# EAGLE design 4-IN-OPTPO-4-OUT (EAGLE 7.7.0)
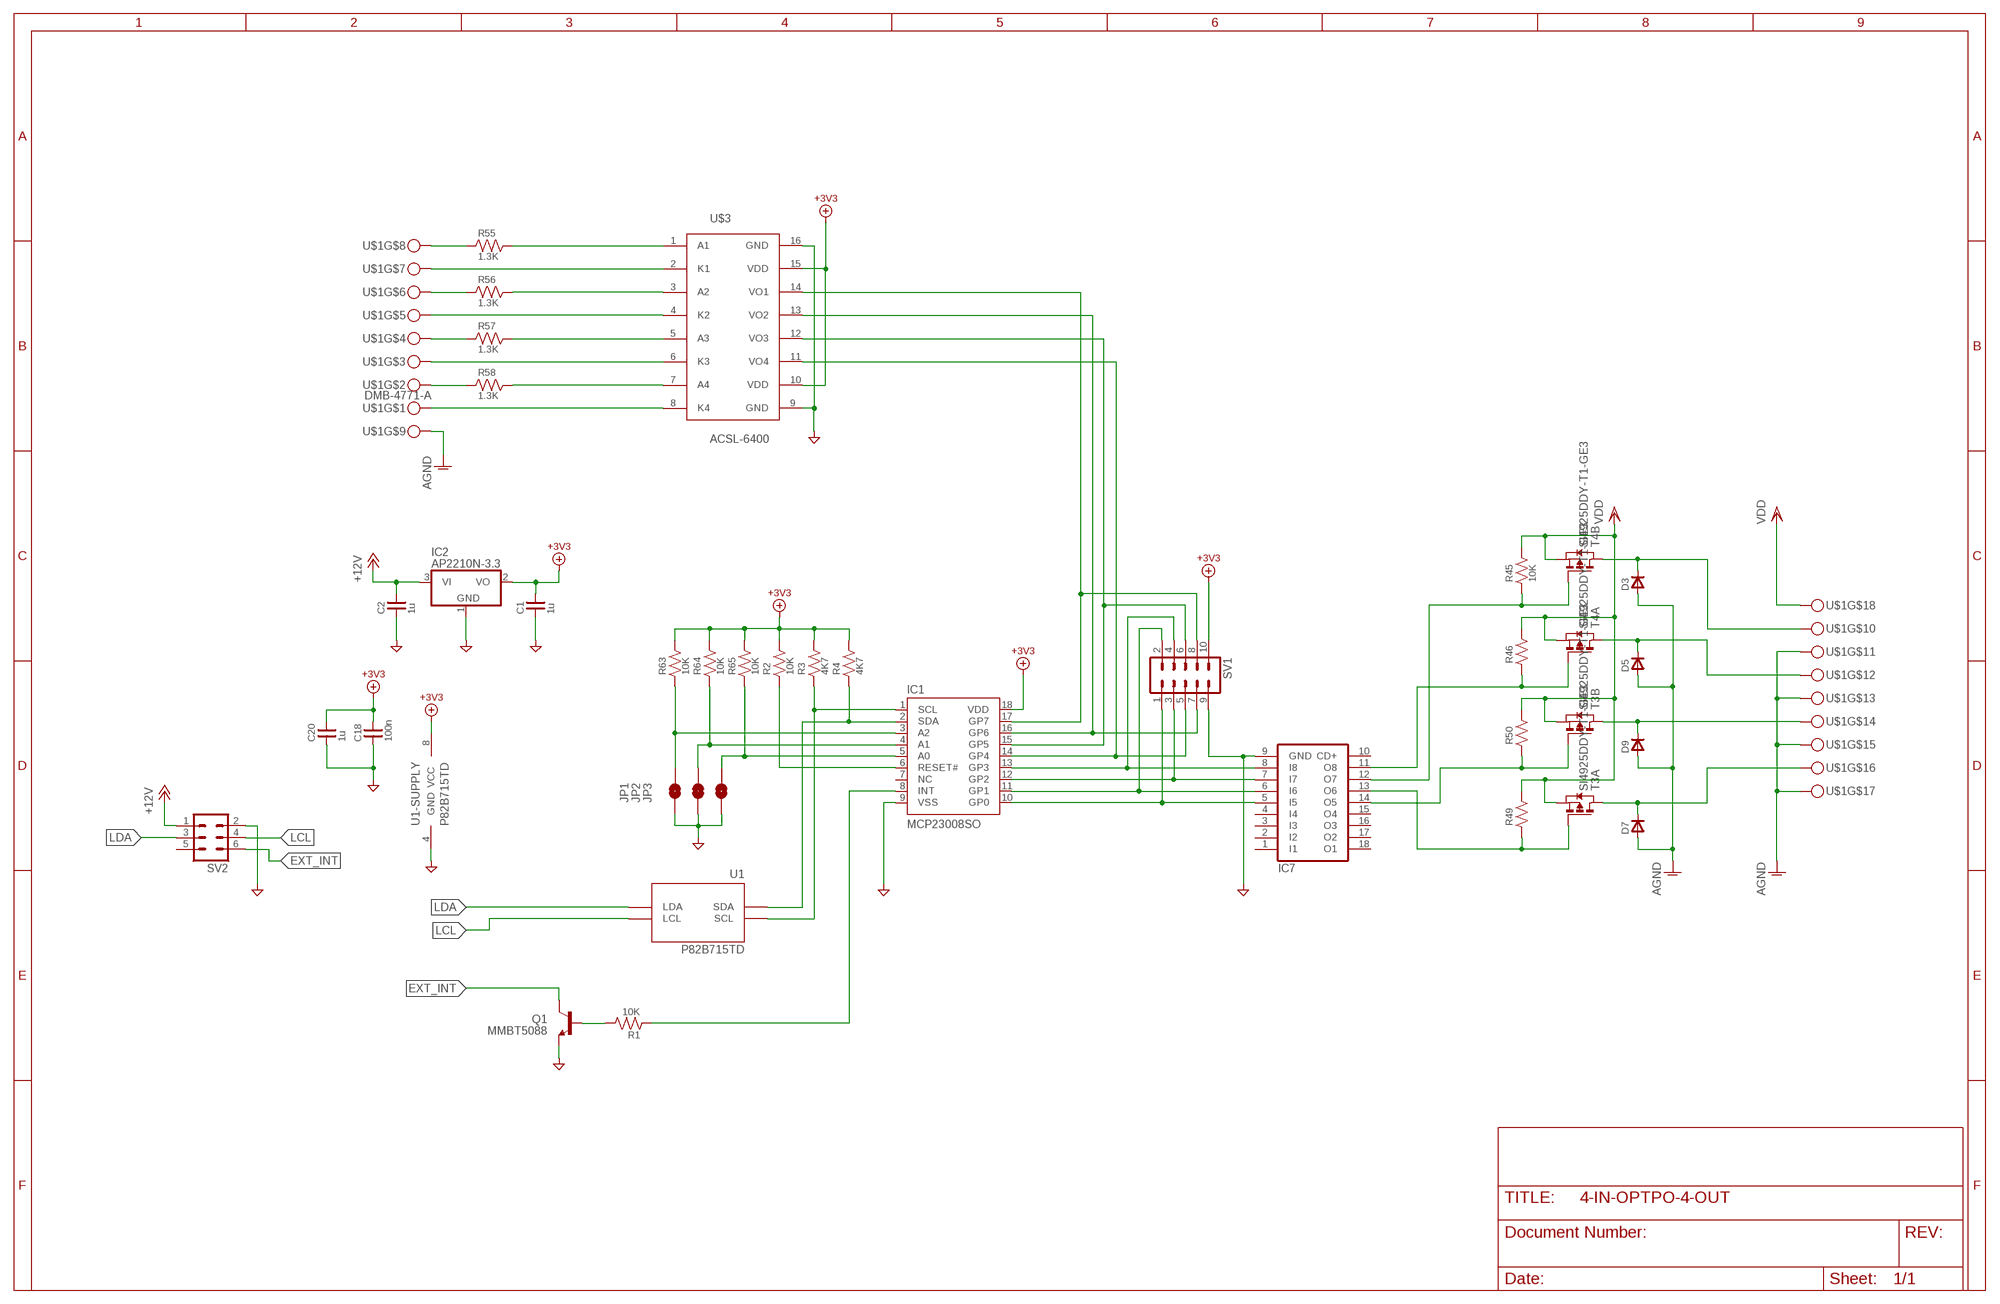
[diagram p0: schematic, sheet 1]

## Parts
C1  1u  C0805  [C0805]
C2  1u  C0805  [C0805]
C18  100n  C0805  [C0805]
C20  1u  C0805  [C0805]
D3  DSMA  [DSMA]
D5  DSMA  [DSMA]
D7  DSMA  [DSMA]
D9  DSMA  [DSMA]
IC1  MCP23008SO  [SO-18W]
IC2  AP2210N-3.3  MCP1703CB  [SOT23]
IC7  ULN2803A  [SO18W]
JP1  JUMPER-PAD-2-NOYES_SILK  [PAD-JUMPER-2-NO_YES_SILK]
JP2  JUMPER-PAD-2-NOYES_SILK  [PAD-JUMPER-2-NO_YES_SILK]
JP3  JUMPER-PAD-2-NOYES_SILK  [PAD-JUMPER-2-NO_YES_SILK]
Q1  MMBT5088  TRANSISTOR_NPNMMBT5088  [SOT23-3]
R1  10K  RU0805  [R0805]
R2  10K  RU0805  [R0805]
R3  4K7  RU0805  [R0805]
R4  4K7  RU0805  [R0805]
R45  10K  RU0805  [R0805]
R46  RU0805  [R0805]
R49  RU0805  [R0805]
R50  RU0805  [R0805]
R55  1.3K  RU0805  [R0805]
R56  1.3K  RU0805  [R0805]
R57  1.3K  RU0805  [R0805]
R58  1.3K  RU0805  [R0805]
R63  10K  RU0805  [R0805]
R64  10K  RU0805  [R0805]
R65  10K  RU0805  [R0805]
SV1  ML10  [ML10]
SV2  ML6  [ML6]
T3  SI4925DDY-T1-GE3  PMOS2SO8  [SO8]
T4  SI4925DDY-T1-GE3  PMOS2SO8  [SO8]
U1  P82B715TD  [SOIC-8]
U$1  DMB-4771-A  [DMB-4771-A-PKG]
U$3  ACSL-6400  [SO16]

## Nets
+3V3: C1.2 C18.2 C20.2 IC1.18(VDD) IC2.2(VO) R2.2 R3.2 R4.2 R63.2 R64.2 R65.2 SV1.10 U1.8(VCC) U$3.10(VDD) U$3.15(VDD) ; supply symbol labelled V+3V3
+12VBUS: C2.2 IC2.3(VI) SV2.1 ; supply symbol labelled +12V
AGND: D3.A D5.A D7.A D9.A U$1.P$9 U$1.P$11 U$1.P$13 U$1.P$15 U$1.P$17
DGND: C1.1 C2.1 C18.1 C20.1 IC1.9(VSS) IC2.1(GND) IC7.9(GND) JP1.1 JP2.1 JP3.1 Q1.2(E) SV1.9 SV2.2 U1.4(GND) U$3.9(GND) U$3.16(GND) ; supply symbol labelled VDG
EXT_INT: Q1.3(C) SV2.6
LCL: SV2.4 U1.2(LCL)
LDA: SV2.3 U1.7(LDA)
N$1: R55.1 U$1.P$8
N$2: R56.1 U$1.P$6
N$3: R57.1 U$1.P$4
N$4: R58.1 U$1.P$2
N$5: IC1.13(GP3) IC7.8(I8) SV1.4
N$6: IC1.12(GP2) IC7.7(I7) SV1.3
N$7: IC1.11(GP1) IC7.6(I6) SV1.2
N$8: IC1.10(GP0) IC7.5(I5) SV1.1
N$9: IC1.1(SCL) R3.1 U1.3(SCL)
N$10: IC1.2(SDA) R4.1 U1.6(SDA)
N$11: IC1.8(INT) R1.1
N$12: Q1.1(B) R1.2
N$13: IC1.6(RESET#) R2.1
N$16: IC1.16(GP6) SV1.7 U$3.13(VO2)
N$17: U$1.P$7 U$3.2(K1)
N$18: U$1.P$5 U$3.4(K2)
N$19: U$1.P$3 U$3.6(K3)
N$20: U$1.P$1 U$3.8(K4)
N$80: IC7.12(O7) R45.1 T4.4(B:G)
N$81: IC7.11(O8) R46.1 T4.2(A:G)
N$82: IC7.13(O6) R49.1 T3.2(A:G)
N$83: IC7.14(O5) R50.1 T3.4(B:G)
N$95: D3.C T4.5(B:D) T4.6(B:D) U$1.P$10
N$96: D5.C T4.7(A:D) T4.8(A:D) U$1.P$12
N$97: D7.C T3.7(A:D) T3.8(A:D) U$1.P$16
N$98: D9.C T3.5(B:D) T3.6(B:D) U$1.P$14
N$111: R55.2 U$3.1(A1)
N$112: R56.2 U$3.3(A2)
N$113: R57.2 U$3.5(A3)
N$114: R58.2 U$3.7(A4)
N$125: IC1.17(GP7) SV1.8 U$3.14(VO1)
N$129: IC1.15(GP5) SV1.6 U$3.12(VO3)
N$131: IC1.14(GP4) SV1.5 U$3.11(VO4)
N$132: IC1.5(A0) JP3.2 R65.1
N$133: IC1.4(A1) JP2.2 R64.1
N$134: IC1.3(A2) JP1.2 R63.1
VDD: R45.2 R46.2 R49.2 R50.2 T3.1(A:S) T3.3(B:S) T4.1(A:S) T4.3(B:S) U$1.P$18
Unconnected: IC1.7(NC) IC7.1(I1) IC7.2(I2) IC7.3(I3) IC7.4(I4) IC7.10(CD+) IC7.15(O4) IC7.16(O3) IC7.17(O2) IC7.18(O1) SV2.5

## Library data of the parts
C1 C2 C18 C20 = divers:C: Capacitor bipolar
D3 D5 D7 D9 = diodes:D: Diode
IC1 = microchip-dspic:MCP23008: 8-Bit I/O Expander with I2C Interface
IC2 = linear:MCP1703: 250 mA, 16V, Low Quiescent Current LDO Regulator Source: http://ww1.microchip.com/downloads/en/DeviceDoc/22049b.pdf
IC7 = uln-udn:ULN2803A: DRIVER ARRAY
JP1-JP3 = SparkFun-Passives:JUMPER-PAD-2-NO
Q1 = SparkFun-DiscreteSemi:TRANSISTOR_NPN: Generic NPN BJT MMBT2222A - TRANS-08049 (SOT-23, 1A 40V) MPSA42 - TRANS-09116 (SOT-23, 500mA 300V) MMBT5088LT1G - TRANS-11160 (SOT-23, 50 mA 30V) BC547 - COM-08928 <http://www.sparkfun.com/products/8928> (TO-92 45V 100mA) (1.Collector 2.Base 3.Emitter) 2N3904 - COM-00521 <http://www.sparkfun.com/products/521> (TO-92 40V 200mA) (1.Emitter 2.Base 3.Collector) P2N2222A - COM-12852 <http://www.sparkfun.com/products/12852> (TO-92 40V 600mA) (1.Collector 2.Base 3.Emitter); PROD_ID: TRANS-11160
R1-R4 R45 R46 R49 R50 R55-R58 R63-R65 = divers:RU: Resistor, US symbol
SV1 = con-harting-ml:ML10: HARTING; OC_FARNELL: unknown; OC_NEWARK: unknown
SV2 = con-harting-ml:ML6: HARTING; OC_FARNELL: unknown; OC_NEWARK: unknown
T3 T4 = zetex:PMOS2: DUAL 30V P-CHANNEL ENHANCEMENT MODE MOSFET Source: Data sheet <http://www.diodes.com/datasheets/ZXMP3A16DN8.pdf> SOP8 Source: Data sheet <http://www.diodes.com/datasheets/ZXMD63P03X.pdf> MSOP8; OC_FARNELL: unknown; OC_NEWARK: unknown
U1 = Volks73-NXPSemiconductors:P82B715?: I2C-Bus Extender I2C-bus extender Documentation Datasheet <http://www.nxp.com/documents/data_sheet/P82B715.pdf> General Description The P82B715 is a bipolar IC intended for application in I2C-bus and derivative bus systems. While retaining all the operating modes and features of the I2C-bus it permits extension of the practical separation distance between components on the I2C-bus by buffering both the data (SDA) and the clock (SCL) lines. The I2C-bus capacitance limit of 400 pF restricts practical communication distances to a few meters. Using one P82B715 at each end of a long cable (connecting Lx/Ly to Lx/Ly) reduces that cable’s loading on the linked I2C-buses by a factor of 10 and allows the total system capacitance load (all devices, cable, connectors, and traces or wires connected to the I2C-bus) to be around 3000 pF while the loading on each I2C-bus on the Sx/Sy sides remains below 400 pF. Longer cables or low-cost, general-purpose wiring may be used to link I2C-bus based modules without degrading noise margins. Multiple P82B715s can be connected together, linking their Lx/Ly ports, in a star or multi-point architecture as long as the total capacitance of the system is less than about 3000 pF and each bus at an Sx/Sy connection is well below 400 pF. This configuration, with the master and/or slave devices attached to the Sx/Sy port of each P82B715, has full multi-master communication capability. The P82B715 alone does not support voltage level translation, but it can be simply implemented using low cost transistors when required. There is no restriction on interconnecting the Sx/Sy I/Os, and, because the device output levels are always held within 100 mV of input drive levels, P82B715 is compatible with bus buffers that use voltage level offsets, e.g., PCA9511A, PCA9517, Sx/Sy side of P82B96. The lower VOL level and ability to operate with any master, slave or bus buffer is the primary advantage of the using the P82B715 for long distance buses at the disadvantage of not isolating bus capacitance like the P82B96 or PCA9600 are able to do. The primary disadvantage of the P82B96 and PCA9600 is that the static level offset needed to isolate bus capacitance does not allow these devices to operate with other bus buffers with special offset levels or with master/slaves that require a VIL lower than 0.8 V with noise margin. A proven quick design-in point-to-point/multi-point circuit (Figure 9) is included in Section 8.2 to allow rapid use of the P82B715 along with comparison waveforms so that the designer can clearly see the trade-offs between the P82B715 and the P82B96/PCA9600 and choose the type of device that is best for their application. Features Dual, bidirectional, unity voltage gain buffer with no external directional control required Compatible with I2C-bus and its derivatives SMBus, PMBus, DDC, etc. Logic signal levels may include (but not exceed) both supply and ground Logic signal input voltage levels are output without change and are independent of VCC ×10 impedance transformation, but does not change logic voltage levels Supply voltage range 3 V to 12 V Clock speeds to at least 100 kHz and 400 kHz when other system delays permit ESD protection exceeds 2500 V HBM per Mil. Std 883C-3015.7 and 400 V MM per JESD22-A115 (I/Os have diodes to VCC and GND) Latch-up testing is done to JEDEC Standard JESD78 which exceeds 100 mA Applications Increase the total connected capacitance of an I2C-bus system to around 3000 pF Drive I2C-bus signals over long cables to approximately 50 meters or 3000 pF Drives ×10 lower impedance bus wiring for improved noise immunity Multi-drop distribution of I2C-bus signals using low cost twisted-pair cables AdvancedTCA radial IPMB architecture Driving 30 mA Fm+ devices from standard 3 mA parts; APPLICATIONS: I2C; CAPACITANCE-INPUT: 3000pF; CURRENT_SUPPLY: 22mA; DATA_RATE: 400kHz; DELAY_TIME: -; DESCRIPTION: IC REDRIVER I2C 1CH 400KHZ 8SO; DOCUMENTATION_LINK: <a href="http://www.nxp.com/documents/data_sheet/P82B715.pdf">Datasheet</a>; DOCUMENTATION_URL: http://www.nxp.com/documents/data_sheet/P82B715.pdf; INPUT: 2-Wire Buse; MANUFACTURER: NXP Semiconductors; NUMBER_OF_CHANNELS: 1; OPERATING_TEMPERATURE: -40C ~ 85C; OUTPUT: 2-Wire Bus; PART_NUMBER: P82B715TD,118; SIGNAL_CONDITIONING: -; SUPPLIER_ITEM_LINK: <a href="http://www.digikey.com/product-detail/en/P82B715TD,118/568-1007-2-ND/735621">Details</a>; SUPPLIER_ITEM_NUMBER: 568-1007-2-ND; SUPPLIER_ITEM_URL: http://www.digikey.com/product-detail/en/P82B715TD,118/568-1007-2-ND/735621; SUPPLIER_LINK: <a href="http://www.digikey.com">Home Page</a>; SUPPLIER_NAME: Digi-Key; SUPPLIER_URL: http://www.digikey.com; TYPE: Buffer, ReDriver; VOLTAGE_SUPPLY: 4.5V ~ 12V
U$1 = Cedric:DMB-4771-A
U$3 = avago:ACSL-6400

## Board
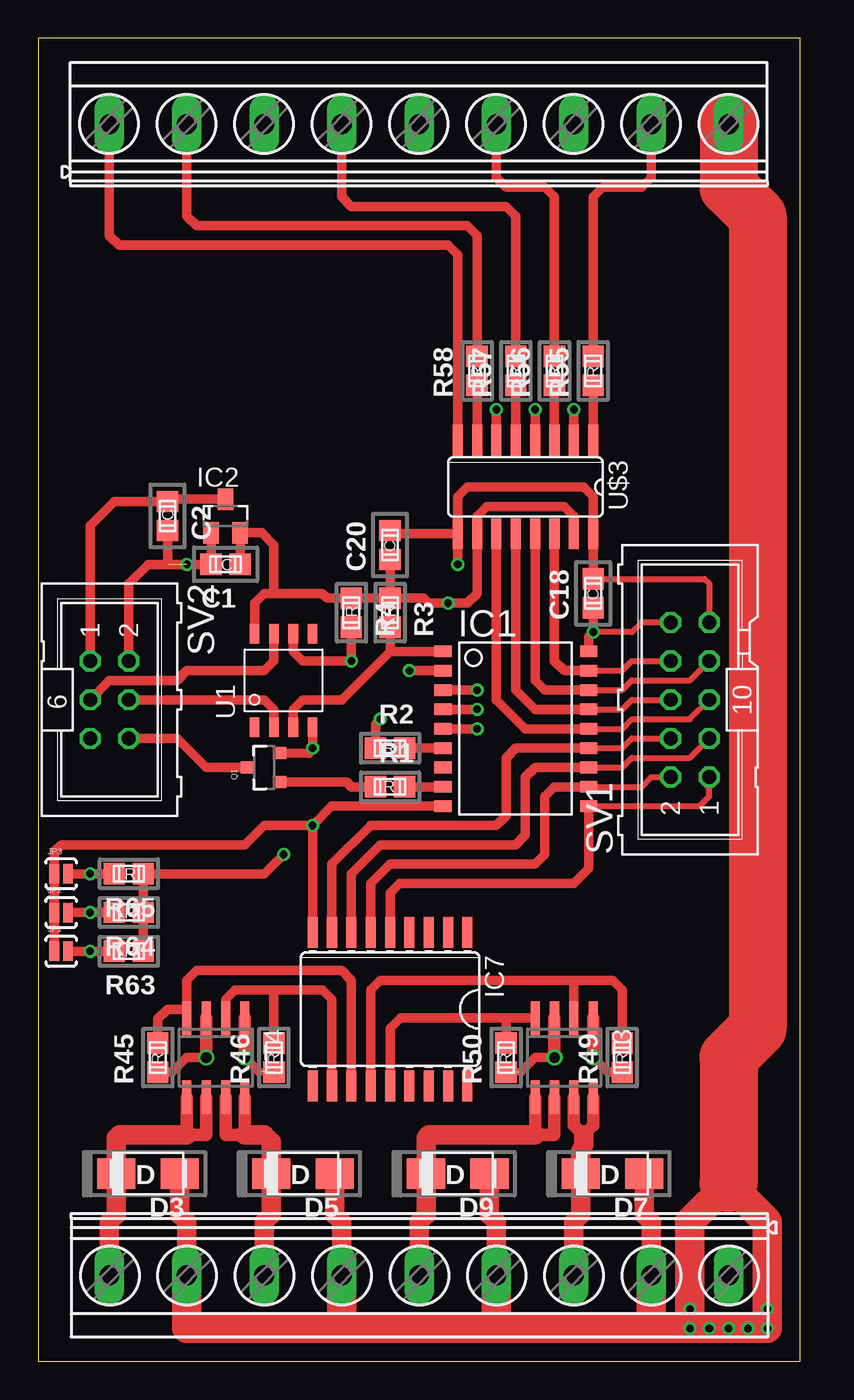
[diagram p1: board, top side]
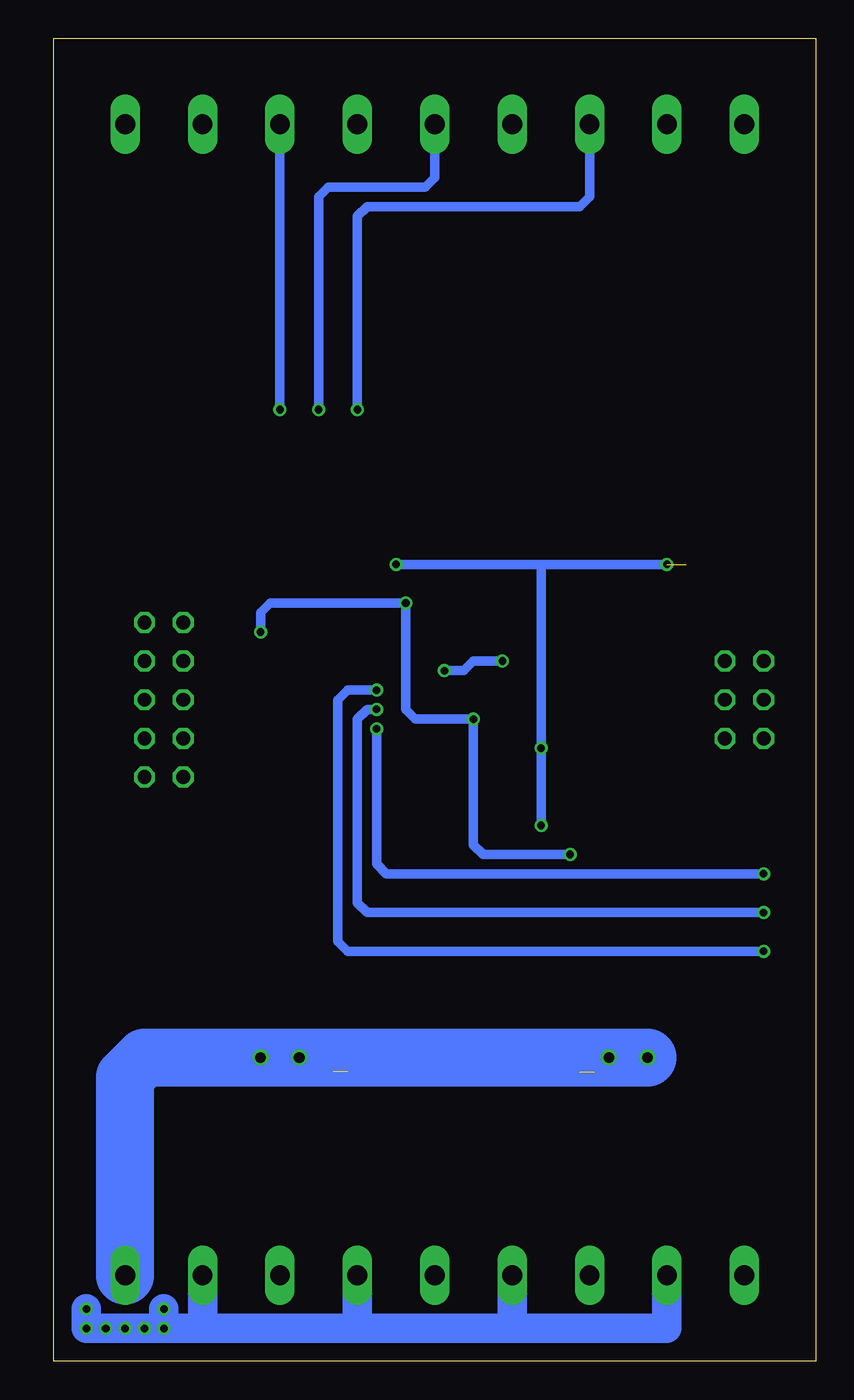
[diagram p2: board, bottom side, seen from below]

Size 50.01 x 86.89 mm. Coordinates in mm from the lower left corner, seen from the top.
Copper layers (1*16): Top 0.0356mm / dielectric 1.5011mm / Bottom 0.0356mm
Design rules "oshpark-2layer": minimum track width 6mil, minimum drill 13mil, track to track 6mil, track to pad 6mil, pad to pad 6mil, via to via 6mil, smd to smd 6mil, copper to edge 15mil, drill to drill 6mil, minimum pad ring 7mil, minimum via ring 7mil, stop-mask expansion 2.5mil, vias tented up to drill 0mil, thermal gap 10mil

### Footprints (pad centres in the part's own frame; a part is rotated, then mirrored left to right if it is on the bottom)
C0805 = smd 1.397 x 1.397: 1 -0.953,0; 2 0.953,0
DSMA = smd 2.5 x 2: A -2.083,0; C 2.083,0
SO-18W = smd 0.762 x 1.143: 1 -5.08,-4.788; 2 -3.81,-4.788; 3 -2.54,-4.788; 4 -1.27,-4.788; 5 0,-4.788; 6 1.27,-4.788; 7 2.54,-4.788; 8 3.81,-4.788; 9 5.08,-4.788; 10 5.08,4.788; 11 3.81,4.788; 12 2.54,4.788; 13 1.27,4.788; 14 0,4.788; 15 -1.27,4.788; 16 -2.54,4.788; 17 -3.81,4.788; 18 -5.08,4.788
SOT23 = smd 1 x 1.4: 1 -0.95,-1.1; 2 0.95,-1.1; 3 0,1.1
SO18W = smd 0.66 x 2.032: 1 -5.08,-5.029; 2 -3.81,-5.029; 3 -2.54,-5.029; 4 -1.27,-5.029; 5 0,-5.029; 6 1.27,-5.029; 7 2.54,-5.029; 8 3.81,-5.029; 9 5.08,-5.029; 10 5.08,5.029; 11 3.81,5.029; 12 2.54,5.029; 13 1.27,5.029; 14 0,5.029; 15 -1.27,5.029; 16 -2.54,5.029; 17 -3.81,5.029; 18 -5.08,5.029
PAD-JUMPER-2-NO_YES_SILK = smd 0.635 x 1.27: 1 -0.45,0; 2 0.45,0
SOT23-3 = smd 0.8 x 0.9: 1 -0.95,-1; 2 0.95,-1; 3 0,1.1
R0805 = smd 1.397 x 1.397: 1 -0.953,0; 2 0.953,0
ML10 = drill 0.914 octagon: 1 -5.08,-1.27; 2 -5.08,1.27; 3 -2.54,-1.27; 4 -2.54,1.27; 5 0,-1.27; 6 0,1.27; 7 2.54,-1.27; 8 2.54,1.27; 9 5.08,-1.27; 10 5.08,1.27
ML6 = drill 0.914 octagon: 1 -2.54,-1.27; 2 -2.54,1.27; 3 0,-1.27; 4 0,1.27; 5 2.54,-1.27; 6 2.54,1.27
SO8 = smd 0.6 x 2.2: 1 -1.905,-2.6; 2 -0.635,-2.6; 3 0.635,-2.6; 4 1.905,-2.6; 5 1.905,2.6; 6 0.635,2.6; 7 -0.635,2.6; 8 -1.905,2.6
SOIC-8 = smd 1.27 x 0.635: 1 -3.073,1.905; 2 -3.073,0.635; 3 -3.073,-0.635; 4 -3.073,-1.905; 5 3.073,-1.905; 6 3.073,-0.635; 7 3.073,0.635; 8 3.073,1.905
DMB-4771-A-PKG = drill 1.3 long: P$1 -20.32,37.795; P$2 -15.24,37.795; P$3 -10.16,37.795; P$4 -5.08,37.795; P$5 0,37.795; P$6 5.08,37.795; P$7 10.16,37.795; P$8 15.24,37.795; P$9 20.32,37.795; P$10 -20.32,-37.795; P$11 -15.24,-37.795; P$12 -10.16,-37.795; P$13 -5.08,-37.795; P$14 0,-37.795; P$15 5.08,-37.795; P$16 10.16,-37.795; P$17 15.24,-37.795; P$18 20.32,-37.795
SO16 = smd 0.66 x 2.032: 1 -4.445,-3.073; 2 -3.175,-3.073; 3 -1.905,-3.073; 4 -0.635,-3.073; 5 0.635,-3.073; 6 1.905,-3.073; 7 3.175,-3.073; 8 4.445,-3.073; 9 4.445,3.073; 10 3.175,3.073; 11 1.905,3.073; 12 0.635,3.073; 13 -0.635,3.073; 14 -1.905,3.073; 15 -3.175,3.073; 16 -4.445,3.073

### Placement (x,y rotation side)
C1  12.31,52.34 0 top
C2  8.5,55.51 90 top
C18  36.44,50.43 270 top
C20  23.1,53.61 270 top
D3  7.23,12.33 180 top
D5  17.39,12.33 180 top
D7  37.71,12.33 180 top
D9  27.55,12.33 180 top
IC1  31.36,41.54 270 top
IC2  12.31,55.51 0 top
IC7  23.1,23.13 180 top
JP1  1.51,26.94 0 top
JP2  1.51,29.48 0 top
JP3  1.51,32.02 0 top
Q1  14.85,39 90 top
R1  23.1,37.73 180 top
R2  23.1,40.27 180 top
R3  23.1,49.16 90 top
R4  20.56,49.16 90 top
R45  7.86,19.95 270 top
R46  15.48,19.95 270 top
R49  38.34,19.95 270 top
R50  30.72,19.95 270 top
R55  36.44,65.04 270 top
R56  33.9,65.04 270 top
R57  31.36,65.04 270 top
R58  28.82,65.04 270 top
R63  5.96,26.94 0 top
R64  5.96,29.48 0 top
R65  5.96,32.02 0 top
SV1  42.79,43.45 90 top
SV2  4.69,43.45 270 top
T3  34.53,19.95 180 top
T4  11.67,19.95 180 top
U1  16.12,44.72 90 top
U$1  25.01,43.45 0 top
U$3  31.99,57.42 180 top

### Tracks (layer width: path | path; a pad name or v marks a point on that pad's centre or on a via)
+3V3  (via drill 0.5)
  Top 0.406: SV1.10 39.61,48.53 38.98,47.89 v36.44,47.89
  Top 0.61: U1.8 14.21,49.8 14.85,50.43 15.48,50.43 | 15.48,50.43 18.66,50.43 18.97,50.11 R4.2 R3.2 | R3.2 25.32,50.11 25.64,49.8 v26.91,49.8 28.18,49.8 28.82,50.43 U$3.10 28.82,55.51 29.45,56.15 34.53,56.15 35.17,55.51 U$3.15 | R2.2 22.15,41.86 v22.47,42.18 | C1.2 IC2.2 14.68,54.41 15.48,53.61 15.48,50.43 | R63.2 R64.2 R65.2 14.85,32.02 v16.12,33.29 | C20.2 R3.2 | C18.2 v36.44,47.89 36.14,47.6 IC1.18
  Bottom 0.61: v36.44,47.89 36.44,49.16 35.8,49.8 v26.91,49.8 26.91,42.81 26.28,42.18 v22.47,42.18 22.47,33.92 21.83,33.29 v16.12,33.29
+12VBUS
  Top 0.61: IC2.3 8.64,56.61 C2.2 5,56.46 3.42,54.88 SV2.1
AGND  (via drill 0.5)
  Top 1.27: U$1.P$11 9.77,9.16 9.31,9.61 D3.A | U$1.P$15 30.09,9.16 29.63,9.61 D9.A | U$1.P$17 40.25,9.16 39.79,9.61 D7.A | U$1.P$13 19.93,9.16 19.47,9.61 D5.A
  Top 1.93: 45.33,11.7 42.79,9.16 v42.79,3.44 v42.79,2.17 v44.06,2.17 v45.33,2.17 v46.6,2.17 v47.87,2.17 v47.87,3.44 47.87,9.16 45.33,11.7
  Top 3.81: U$1.P$9 45.33,77.1 47.23,75.2 47.23,21.86 45.33,19.95 45.33,11.7
  Bottom 1.93: v42.79,2.17 40.25,2.17 | 40.25,2.17 30.09,2.17 | 30.09,2.17 19.93,2.17 | 19.93,2.17 9.77,2.17 U$1.P$11 | U$1.P$13 19.93,2.17 | U$1.P$15 30.09,2.17 | 40.25,2.17 U$1.P$17 | v42.79,2.17 v44.06,2.17 v45.33,2.17 v46.6,2.17 v47.87,2.17 v47.87,3.44 | v42.79,2.17 v42.79,3.44
AGND1
  Top 1.93: 42.79,2.17 40.25,2.17 | 40.25,2.17 30.09,2.17 | 30.09,2.17 19.93,2.17 | 19.93,2.17 9.77,2.17 9.77,5.65 | 19.93,5.65 19.93,2.17 | 30.09,5.65 30.09,2.17 | 40.25,2.17 40.25,5.65
DGND  (via drill 0.5)  (1 unrouted)
  Top 0.406: C18.1 43.74,51.38 44.06,51.07 SV1.9
  Top 0.61: IC1.9 19.29,36.46 v18.02,35.19 | v18.02,35.19 IC7.9 | U1.4 v18.02,40.27 17.75,39.91 Q1.2 | U$3.9 27.55,56.78 28.18,57.42 35.8,57.42 36.44,56.78 U$3.16 36.44,52.02 C18.1 | 8.5,52.34 C1.1 IC2.1 | 8.5,52.34 7.23,52.34 5.96,51.07 SV2.2 | C2.1 8.5,52.34 | 8.5,52.34 | JP1.1 JP2.1 JP3.1 1.06,33.47 1.51,33.92 13.58,33.92 14.85,35.19 v18.02,35.19 | U$3.9 23.32,54.34 C20.1 | U$3.9 v27.55,52.34
  Bottom 0.61: v18.02,35.19 v18.02,40.27 18.02,52.34 | v9.77,52.34 18.02,52.34 | 18.02,52.34 v27.55,52.34
EXT_INT
  Top 0.61: Q1.3 11.04,39 9.13,40.91 SV2.6
LCL
  Top 0.61: SV2.4 14.85,43.45 15.48,42.81 U1.2
LDA
  Top 0.61: U1.7 15.48,45.99 14.85,45.35 9.77,45.35 9.13,44.72 4.69,44.72 SV2.3
N$1
  Top 0.61: U$1.P$8 40.25,77.74 39.61,77.1 37.07,77.1 36.44,76.47 R55.1 | R55.1
N$2
  Top 0.61: U$1.P$6 30.09,77.74 30.72,77.1 33.26,77.1 33.9,76.47 R56.1 | R56.1
N$3
  Top 0.61: U$1.P$4 19.93,76.47 20.56,75.83 30.72,75.83 31.36,75.2 R57.1 | R57.1
N$4
  Top 0.61: U$1.P$2 9.77,75.2 10.4,74.56 28.18,74.56 28.82,73.93 R58.1 | R58.1
N$5
  Top 0.406: IC1.13 38.34,40.27 38.98,40.91 SV1.4
  Top 0.61: IC7.8 19.29,32.65 21.83,35.19 30.09,35.19 30.72,35.83 30.72,39.64 31.36,40.27 IC1.13
N$6
  Top 0.406: IC1.12 38.34,39 38.98,39.64 42.79,39.64 SV1.3
  Top 0.61: IC7.7 20.56,32.02 22.47,33.92 31.36,33.92 31.99,34.56 31.99,38.37 32.63,39 IC1.12
N$7
  Top 0.406: IC1.11 39.61,37.73 40.25,38.37 SV1.2
  Top 0.61: IC7.6 21.83,31.38 23.1,32.65 32.63,32.65 33.26,33.29 33.26,37.1 33.9,37.73 IC1.11
N$8
  Top 0.406: IC1.10 43.42,36.46 44.06,37.1 SV1.1
  Top 0.61: IC7.5 23.1,30.75 23.74,31.38 35.17,31.38 36.14,32.36 IC1.10
N$9
  Top 0.61: 23.1,46.62 IC1.1 | R3.1 23.1,47.26 23.1,46.62 | U1.3 16.75,42.81 17.39,43.45 19.93,43.45 23.1,46.62
N$10  (via drill 0.5)
  Top 0.61: IC1.2 v24.37,45.35 | R4.1 20.56,47.26 v20.56,45.99 17.39,45.99 16.75,46.62 U1.6
  Bottom 0.61: v24.37,45.35 23.1,45.35 22.47,45.99 v20.56,45.99
N$11
  Top 0.61: IC1.8 R1.1 | R1.1
N$12
  Top 0.61: Q1.1 20.25,38.05 20.56,37.73 R1.2
N$13
  Top 0.61: IC1.6 R2.1 | R2.1
N$16
  Top 0.406: IC1.16 38.34,44.08 38.98,44.72 42.79,44.72 SV1.7
  Top 0.61: IC1.16 33.26,44.08 32.63,44.72 U$3.13
N$17  (via drill 0.5)
  Top 0.61: U$3.2 v35.17,62.5
  Bottom 0.61: v35.17,62.5 U$1.P$7
N$18  (via drill 0.5)
  Top 0.61: v32.63,62.5 U$3.4
  Bottom 0.61: U$1.P$5 25.01,77.74 25.64,77.1 31.99,77.1 32.63,76.47 v32.63,62.5
N$19  (via drill 0.5)
  Top 0.61: U$3.6 v30.09,62.5
  Bottom 0.61: v30.09,62.5 30.09,75.2 29.45,75.83 15.48,75.83 14.85,76.47 U$1.P$3
N$20
  Top 0.61: U$3.8 27.55,72.66 26.91,73.29 5.32,73.29 4.69,73.93 U$1.P$1
N$80
  Top 0.61: IC7.12 20.56,25.03 19.93,25.67 10.4,25.67 9.77,25.03 9.77,23.13 | 9.77,23.13 T4.4 | R45.1 7.86,22.49 8.5,23.13 9.77,23.13
N$81
  Top 0.61: T4.2 12.31,23.76 12.94,24.4 15.48,24.4 | 15.48,24.4 18.66,24.4 19.29,23.76 IC7.11 | R46.1 15.48,20.59 | 15.48,20.59 | 15.48,20.59 15.48,24.4
N$82
  Top 0.61: T3.2 35.17,25.03 | 35.17,25.03 22.47,25.03 21.83,24.4 IC7.13 | R49.1 38.34,24.4 37.71,25.03 35.17,25.03
N$83
  Top 0.61: T3.4 30.72,22.55 | 30.72,22.55 23.8,22.55 23.1,21.86 IC7.14 | R50.1 30.72,22.55 | 30.72,22.55
N$95
  Top 0.813: T4.6 11.04,14.87 9.77,14.87 T4.5
  Top 1.27: U$1.P$10 4.69,9.16 5.14,9.61 D3.C 5.14,14.69 5.32,14.87 9.77,14.87
N$96
  Top 0.813: T4.7 12.31,14.87 13.58,14.87 T4.8
  Top 1.27: U$1.P$12 14.85,9.16 15.3,9.61 D5.C 15.3,14.41 14.85,14.87 13.58,14.87
N$97
  Top 0.813: T3.7 35.17,15.51 35.8,14.87 36.44,15.51 T3.8
  Top 1.27: U$1.P$16 35.17,9.16 35.62,9.61 D7.C 35.62,13.78 35.8,14.24 35.8,14.87
N$98
  Top 0.813: T3.6 33.9,14.87 32.63,14.87 T3.5
  Top 1.27: U$1.P$14 25.01,9.16 25.46,9.61 D9.C 25.46,14.69 25.64,14.87 32.63,14.87
N$111
  Top 0.61: U$3.1 R55.2
N$112
  Top 0.61: U$3.3 R56.2
N$113
  Top 0.61: U$3.5 R57.2
N$114
  Top 0.61: U$3.7 R58.2
N$125
  Top 0.406: IC1.17 38.34,45.35 38.98,45.99 SV1.8
  Top 0.61: IC1.17 34.53,45.35 33.9,45.99 U$3.14
N$129
  Top 0.406: IC1.15 38.34,42.81 38.98,43.45 SV1.6
  Top 0.61: IC1.15 32.63,42.81 31.36,44.08 U$3.12
N$131
  Top 0.406: IC1.14 38.34,41.54 38.98,42.18 42.79,42.18 SV1.5
  Top 0.61: IC1.14 31.99,41.54 30.09,43.45 U$3.11
N$132  (via drill 0.5)
  Top 0.61: IC1.5 v28.82,41.54 | v3.42,32.02 JP3.2 | R65.1 v3.42,32.02 | v3.42,32.02
  Bottom 0.61: v28.82,41.54 28.82,32.65 28.18,32.02 v3.42,32.02
N$133  (via drill 0.5)
  Top 0.61: IC1.4 v28.82,42.81 | v3.42,29.48 JP2.2 | R64.1 v3.42,29.48 | v3.42,29.48
  Bottom 0.61: v28.82,42.81 29.45,42.81 30.09,42.18 30.09,30.11 29.45,29.48 v3.42,29.48
N$134  (via drill 0.5)
  Top 0.61: IC1.3 v28.82,44.08 | v3.42,26.94 JP1.2 | R63.1 v3.42,26.94 | v3.42,26.94
  Bottom 0.61: v28.82,44.08 30.72,44.08 31.36,43.45 31.36,27.57 30.72,26.94 v3.42,26.94
VDD  (via drill 0.7)  (2 unrouted)
  Top 0.61: v36.44,19.95 37.39,19 R49.2 | 31.67,19 32.63,19.95 v33.9,19.95 | 14.53,19 v13.58,19.95 | v11.04,19.95 9.77,19.95 8.81,19 R45.2
  Top 0.813: T4.3 v11.04,19.95 | T4.1 v13.58,19.95 | T3.3 v33.9,19.95 | T3.1 v36.44,19.95
  Bottom 3.81: U$1.P$18 45.33,18.68 44.06,19.95 v36.44,19.95 v33.9,19.95 v13.58,19.95 v11.04,19.95